# Altium schematic sheet DC_Switch_2.SchDoc
size A2
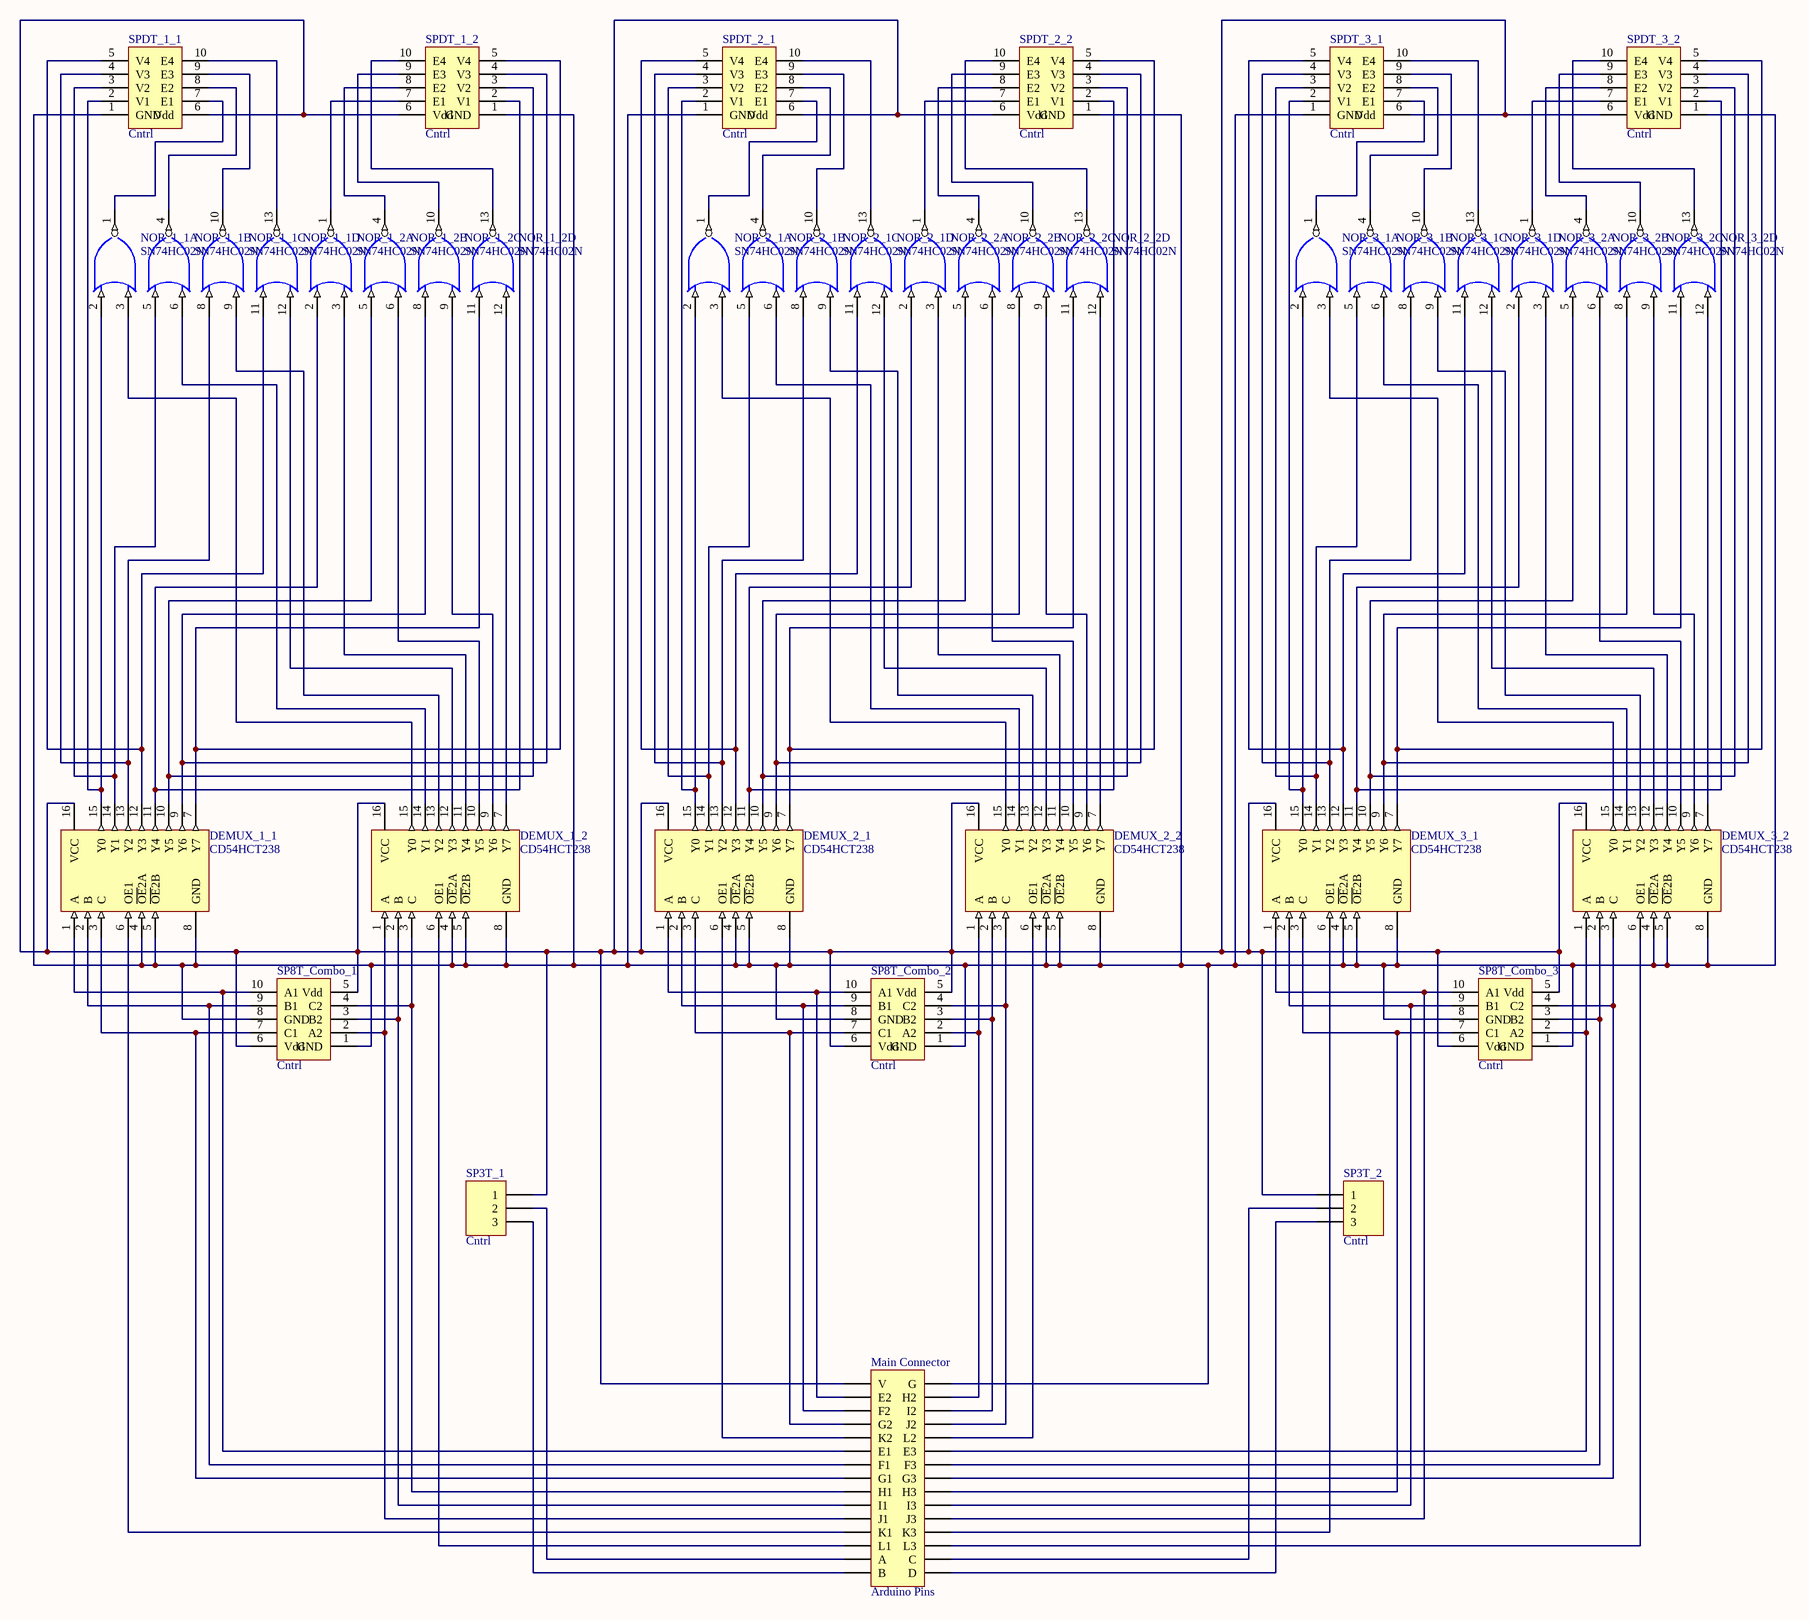
[diagram p0: DC_Switch_2.SchDoc]

## Parts
DEMUX_1_1  CD54HCT238  [J016D]
DEMUX_1_2  CD54HCT238  [J016D]
DEMUX_2_1  CD54HCT238  [J016D]
DEMUX_2_2  CD54HCT238  [J016D]
DEMUX_3_1  CD54HCT238  [J016D]
DEMUX_3_2  CD54HCT238  [J016D]
Main_Connector  Arduino Pins  [HDR2X15_CEN]
NOR_1_1  SN74HC02N  [N014]  (parts A,B,C,D of 4)
NOR_1_2  SN74HC02N  [N014]  (parts A,B,C,D of 4)
NOR_2_1  SN74HC02N  [N014]  (parts A,B,C,D of 4)
NOR_2_2  SN74HC02N  [N014]  (parts A,B,C,D of 4)
NOR_3_1  SN74HC02N  [N014]  (parts A,B,C,D of 4)
NOR_3_2  SN74HC02N  [N014]  (parts A,B,C,D of 4)
SP3T_1  Cntrl  [HDR1X3]
SP3T_2  Cntrl  [HDR1X3]
SP8T_Combo_1  Cntrl  [HDR2X5_CEN]
SP8T_Combo_2  Cntrl  [HDR2X5_CEN]
SP8T_Combo_3  Cntrl  [HDR2X5_CEN]
SPDT_1_1  Cntrl  [HDR2X5_CEN]
SPDT_1_2  Cntrl  [HDR2X5_CEN]
SPDT_2_1  Cntrl  [HDR2X5_CEN]
SPDT_2_2  Cntrl  [HDR2X5_CEN]
SPDT_3_1  Cntrl  [HDR2X5_CEN]
SPDT_3_2  Cntrl  [HDR2X5_CEN]

## Nets
GND: NOR_1_1.7(GND) NOR_1_2.7(GND) NOR_2_1.7(GND) NOR_2_2.7(GND) NOR_3_1.7(GND) NOR_3_2.7(GND)
VCC: NOR_1_1.14(VCC) NOR_1_2.14(VCC) NOR_2_1.14(VCC) NOR_2_2.14(VCC) NOR_3_1.14(VCC) NOR_3_2.14(VCC)
NetDEMUX_1_1_1: DEMUX_1_1.1(A) Main_Connector.6(E1) SP8T_Combo_1.10(A1)
NetDEMUX_1_1_2: DEMUX_1_1.2(B) Main_Connector.7(F1) SP8T_Combo_1.9(B1)
NetDEMUX_1_1_3: DEMUX_1_1.3(C) Main_Connector.8(G1) SP8T_Combo_1.7(C1)
NetDEMUX_1_1_4: DEMUX_1_1.4(~{OE}2A) DEMUX_1_1.5(~{OE}2B) DEMUX_1_1.8(GND) DEMUX_1_2.4(~{OE}2A) DEMUX_1_2.5(~{OE}2B) DEMUX_1_2.8(GND) DEMUX_2_1.4(~{OE}2A) DEMUX_2_1.5(~{OE}2B) DEMUX_2_1.8(GND) DEMUX_2_2.4(~{OE}2A) DEMUX_2_2.5(~{OE}2B) DEMUX_2_2.8(GND) DEMUX_3_1.4(~{OE}2A) DEMUX_3_1.5(~{OE}2B) DEMUX_3_1.8(GND) DEMUX_3_2.4(~{OE}2A) DEMUX_3_2.5(~{OE}2B) DEMUX_3_2.8(GND) Main_Connector.16(G) SP8T_Combo_1.1(GND) SP8T_Combo_1.8(GND) SP8T_Combo_2.1(GND) SP8T_Combo_2.8(GND) SP8T_Combo_3.1(GND) SP8T_Combo_3.8(GND) SPDT_1_1.1(GND) SPDT_1_2.1(GND) SPDT_2_1.1(GND) SPDT_2_2.1(GND) SPDT_3_1.1(GND) SPDT_3_2.1(GND)
NetDEMUX_1_1_6: DEMUX_1_1.6(OE1) Main_Connector.12(K1)
NetDEMUX_1_1_7: DEMUX_1_1.7(Y7) NOR_1_2.11(A) SPDT_1_2.5(V4)
NetDEMUX_1_1_9: DEMUX_1_1.9(Y6) NOR_1_2.8(A) SPDT_1_2.4(V3)
NetDEMUX_1_1_10: DEMUX_1_1.10(Y5) NOR_1_2.5(A) SPDT_1_2.3(V2)
NetDEMUX_1_1_11: DEMUX_1_1.11(Y4) NOR_1_2.2(A) SPDT_1_2.2(V1)
NetDEMUX_1_1_12: DEMUX_1_1.12(Y3) NOR_1_1.11(A) SPDT_1_1.5(V4)
NetDEMUX_1_1_13: DEMUX_1_1.13(Y2) NOR_1_1.8(A) SPDT_1_1.4(V3)
NetDEMUX_1_1_14: DEMUX_1_1.14(Y1) NOR_1_1.5(A) SPDT_1_1.3(V2)
NetDEMUX_1_1_15: DEMUX_1_1.15(Y0) NOR_1_1.2(A) SPDT_1_1.2(V1)
NetDEMUX_1_1_16: DEMUX_1_1.16(VCC) DEMUX_1_2.16(VCC) DEMUX_2_1.16(VCC) DEMUX_2_2.16(VCC) DEMUX_3_1.16(VCC) DEMUX_3_2.16(VCC) Main_Connector.1(V) SP3T_1.1 SP3T_2.1 SP8T_Combo_1.5(Vdd) SP8T_Combo_1.6(Vdd) SP8T_Combo_2.5(Vdd) SP8T_Combo_2.6(Vdd) SP8T_Combo_3.5(Vdd) SP8T_Combo_3.6(Vdd) SPDT_1_1.6(Vdd) SPDT_1_2.6(Vdd) SPDT_2_1.6(Vdd) SPDT_2_2.6(Vdd) SPDT_3_1.6(Vdd) SPDT_3_2.6(Vdd)
NetDEMUX_1_2_1: DEMUX_1_2.1(A) Main_Connector.11(J1) SP8T_Combo_1.2(A2)
NetDEMUX_1_2_2: DEMUX_1_2.2(B) Main_Connector.10(I1) SP8T_Combo_1.3(B2)
NetDEMUX_1_2_3: DEMUX_1_2.3(C) Main_Connector.9(H1) SP8T_Combo_1.4(C2)
NetDEMUX_1_2_6: DEMUX_1_2.6(OE1) Main_Connector.13(L1)
NetDEMUX_1_2_7: DEMUX_1_2.7(Y7) NOR_1_2.12(B)
NetDEMUX_1_2_9: DEMUX_1_2.9(Y6) NOR_1_2.9(B)
NetDEMUX_1_2_10: DEMUX_1_2.10(Y5) NOR_1_2.6(B)
NetDEMUX_1_2_11: DEMUX_1_2.11(Y4) NOR_1_2.3(B)
NetDEMUX_1_2_12: DEMUX_1_2.12(Y3) NOR_1_1.12(B)
NetDEMUX_1_2_13: DEMUX_1_2.13(Y2) NOR_1_1.9(B)
NetDEMUX_1_2_14: DEMUX_1_2.14(Y1) NOR_1_1.6(B)
NetDEMUX_1_2_15: DEMUX_1_2.15(Y0) NOR_1_1.3(B)
NetDEMUX_2_1_1: DEMUX_2_1.1(A) Main_Connector.2(E2) SP8T_Combo_2.10(A1)
NetDEMUX_2_1_2: DEMUX_2_1.2(B) Main_Connector.3(F2) SP8T_Combo_2.9(B1)
NetDEMUX_2_1_3: DEMUX_2_1.3(C) Main_Connector.4(G2) SP8T_Combo_2.7(C1)
NetDEMUX_2_1_6: DEMUX_2_1.6(OE1) Main_Connector.5(K2)
NetDEMUX_2_1_7: DEMUX_2_1.7(Y7) NOR_2_2.11(A) SPDT_2_2.5(V4)
NetDEMUX_2_1_9: DEMUX_2_1.9(Y6) NOR_2_2.8(A) SPDT_2_2.4(V3)
NetDEMUX_2_1_10: DEMUX_2_1.10(Y5) NOR_2_2.5(A) SPDT_2_2.3(V2)
NetDEMUX_2_1_11: DEMUX_2_1.11(Y4) NOR_2_2.2(A) SPDT_2_2.2(V1)
NetDEMUX_2_1_12: DEMUX_2_1.12(Y3) NOR_2_1.11(A) SPDT_2_1.5(V4)
NetDEMUX_2_1_13: DEMUX_2_1.13(Y2) NOR_2_1.8(A) SPDT_2_1.4(V3)
NetDEMUX_2_1_14: DEMUX_2_1.14(Y1) NOR_2_1.5(A) SPDT_2_1.3(V2)
NetDEMUX_2_1_15: DEMUX_2_1.15(Y0) NOR_2_1.2(A) SPDT_2_1.2(V1)
NetDEMUX_2_2_1: DEMUX_2_2.1(A) Main_Connector.17(H2) SP8T_Combo_2.2(A2)
NetDEMUX_2_2_2: DEMUX_2_2.2(B) Main_Connector.18(I2) SP8T_Combo_2.3(B2)
NetDEMUX_2_2_3: DEMUX_2_2.3(C) Main_Connector.19(J2) SP8T_Combo_2.4(C2)
NetDEMUX_2_2_6: DEMUX_2_2.6(OE1) Main_Connector.20(L2)
NetDEMUX_2_2_7: DEMUX_2_2.7(Y7) NOR_2_2.12(B)
NetDEMUX_2_2_9: DEMUX_2_2.9(Y6) NOR_2_2.9(B)
NetDEMUX_2_2_10: DEMUX_2_2.10(Y5) NOR_2_2.6(B)
NetDEMUX_2_2_11: DEMUX_2_2.11(Y4) NOR_2_2.3(B)
NetDEMUX_2_2_12: DEMUX_2_2.12(Y3) NOR_2_1.12(B)
NetDEMUX_2_2_13: DEMUX_2_2.13(Y2) NOR_2_1.9(B)
NetDEMUX_2_2_14: DEMUX_2_2.14(Y1) NOR_2_1.6(B)
NetDEMUX_2_2_15: DEMUX_2_2.15(Y0) NOR_2_1.3(B)
NetDEMUX_3_1_1: DEMUX_3_1.1(A) Main_Connector.26(J3) SP8T_Combo_3.10(A1)
NetDEMUX_3_1_2: DEMUX_3_1.2(B) Main_Connector.25(I3) SP8T_Combo_3.9(B1)
NetDEMUX_3_1_3: DEMUX_3_1.3(C) Main_Connector.24(H3) SP8T_Combo_3.7(C1)
NetDEMUX_3_1_6: DEMUX_3_1.6(OE1) Main_Connector.27(K3)
NetDEMUX_3_1_7: DEMUX_3_1.7(Y7) NOR_3_2.11(A) SPDT_3_2.5(V4)
NetDEMUX_3_1_9: DEMUX_3_1.9(Y6) NOR_3_2.8(A) SPDT_3_2.4(V3)
NetDEMUX_3_1_10: DEMUX_3_1.10(Y5) NOR_3_2.5(A) SPDT_3_2.3(V2)
NetDEMUX_3_1_11: DEMUX_3_1.11(Y4) NOR_3_2.2(A) SPDT_3_2.2(V1)
NetDEMUX_3_1_12: DEMUX_3_1.12(Y3) NOR_3_1.11(A) SPDT_3_1.5(V4)
NetDEMUX_3_1_13: DEMUX_3_1.13(Y2) NOR_3_1.8(A) SPDT_3_1.4(V3)
NetDEMUX_3_1_14: DEMUX_3_1.14(Y1) NOR_3_1.5(A) SPDT_3_1.3(V2)
NetDEMUX_3_1_15: DEMUX_3_1.15(Y0) NOR_3_1.2(A) SPDT_3_1.2(V1)
NetDEMUX_3_2_1: DEMUX_3_2.1(A) Main_Connector.21(E3) SP8T_Combo_3.2(A2)
NetDEMUX_3_2_2: DEMUX_3_2.2(B) Main_Connector.22(F3) SP8T_Combo_3.3(B2)
NetDEMUX_3_2_3: DEMUX_3_2.3(C) Main_Connector.23(G3) SP8T_Combo_3.4(C2)
NetDEMUX_3_2_6: DEMUX_3_2.6(OE1) Main_Connector.28(L3)
NetDEMUX_3_2_7: DEMUX_3_2.7(Y7) NOR_3_2.12(B)
NetDEMUX_3_2_9: DEMUX_3_2.9(Y6) NOR_3_2.9(B)
NetDEMUX_3_2_10: DEMUX_3_2.10(Y5) NOR_3_2.6(B)
NetDEMUX_3_2_11: DEMUX_3_2.11(Y4) NOR_3_2.3(B)
NetDEMUX_3_2_12: DEMUX_3_2.12(Y3) NOR_3_1.12(B)
NetDEMUX_3_2_13: DEMUX_3_2.13(Y2) NOR_3_1.9(B)
NetDEMUX_3_2_14: DEMUX_3_2.14(Y1) NOR_3_1.6(B)
NetDEMUX_3_2_15: DEMUX_3_2.15(Y0) NOR_3_1.3(B)
NetMain_Connector_14: Main_Connector.14(A) SP3T_1.2
NetMain_Connector_15: Main_Connector.15(B) SP3T_1.3
NetMain_Connector_29: Main_Connector.29(C) SP3T_2.2
NetMain_Connector_30: Main_Connector.30(D) SP3T_2.3
NetNOR_1_1_1: NOR_1_1.1(Y) SPDT_1_1.7(E1)
NetNOR_1_1_4: NOR_1_1.4(Y) SPDT_1_1.8(E2)
NetNOR_1_1_10: NOR_1_1.10(Y) SPDT_1_1.9(E3)
NetNOR_1_1_13: NOR_1_1.13(Y) SPDT_1_1.10(E4)
NetNOR_1_2_1: NOR_1_2.1(Y) SPDT_1_2.7(E1)
NetNOR_1_2_4: NOR_1_2.4(Y) SPDT_1_2.8(E2)
NetNOR_1_2_10: NOR_1_2.10(Y) SPDT_1_2.9(E3)
NetNOR_1_2_13: NOR_1_2.13(Y) SPDT_1_2.10(E4)
NetNOR_2_1_1: NOR_2_1.1(Y) SPDT_2_1.7(E1)
NetNOR_2_1_4: NOR_2_1.4(Y) SPDT_2_1.8(E2)
NetNOR_2_1_10: NOR_2_1.10(Y) SPDT_2_1.9(E3)
NetNOR_2_1_13: NOR_2_1.13(Y) SPDT_2_1.10(E4)
NetNOR_2_2_1: NOR_2_2.1(Y) SPDT_2_2.7(E1)
NetNOR_2_2_4: NOR_2_2.4(Y) SPDT_2_2.8(E2)
NetNOR_2_2_10: NOR_2_2.10(Y) SPDT_2_2.9(E3)
NetNOR_2_2_13: NOR_2_2.13(Y) SPDT_2_2.10(E4)
NetNOR_3_1_1: NOR_3_1.1(Y) SPDT_3_1.7(E1)
NetNOR_3_1_4: NOR_3_1.4(Y) SPDT_3_1.8(E2)
NetNOR_3_1_10: NOR_3_1.10(Y) SPDT_3_1.9(E3)
NetNOR_3_1_13: NOR_3_1.13(Y) SPDT_3_1.10(E4)
NetNOR_3_2_1: NOR_3_2.1(Y) SPDT_3_2.7(E1)
NetNOR_3_2_4: NOR_3_2.4(Y) SPDT_3_2.8(E2)
NetNOR_3_2_10: NOR_3_2.10(Y) SPDT_3_2.9(E3)
NetNOR_3_2_13: NOR_3_2.13(Y) SPDT_3_2.10(E4)

## Library data of the parts
DEMUX_1_1 DEMUX_1_2 DEMUX_2_1 DEMUX_2_2 DEMUX_3_1 DEMUX_3_2 = SN54HC238J: 3-Line to 8-Line Decoder / Demultiplexer; Published: 8-Jun-2000; LatestRevisionDate: 04-Mar-2005; LatestRevisionNote: Stylized 3D Model Added.; DatasheetVersion: Jun-1989; PackageVersion: Jun-1999; PackageReference: J016D; Publisher: Altium Limited; PackageDescription: DIP; 16 Leads; Row Spacing 7.62 mm; Pitch 2.54 mm; ComponentLink1Description: Manufacturer Link; ComponentLink1URL: http://www.ti.com/
Main_Connector = Header 15X2A: Header, 15-Pin, Dual row; LatestRevisionDate: 17-Jul-2002; LatestRevisionNote: Re-released for DXP Platform.; Publisher: Altium Limited
NOR_1_1 NOR_1_2 NOR_2_1 NOR_2_2 NOR_3_1 NOR_3_2 = SN74HC02N: Quadruple 2-Input Positive-NOR Gate; Published: 8-Jun-2000; LatestRevisionDate: 04-Mar-2005; LatestRevisionNote: Stylized 3D Model Added.; DatasheetVersion: May-1997; PackageVersion: Oct-1995; PackageReference: N014; Publisher: Altium Limited; PackageDescription: DIP; 14 Leads; Row Spacing 7.62 mm; Pitch 2.54 mm; ComponentLink1Description: Manufacturer Link; ComponentLink1URL: http://www.ti.com/; ComponentLink2Description: Datasheet; ComponentLink2URL: http://www-s.ti.com/sc/ds/sn74hc02.pdf
SP3T_1 SP3T_2 = Header 3: Header, 3-Pin; LatestRevisionDate: 17-Jul-2002; LatestRevisionNote: Re-released for DXP Platform.; Publisher: Altium Limited
SP8T_Combo_1-SP8T_Combo_3 SPDT_1_1 SPDT_1_2 SPDT_2_1 SPDT_2_2 SPDT_3_1 SPDT_3_2 = Header 5X2A: Header, 5-Pin, Dual row; LatestRevisionDate: 17-Jul-2002; LatestRevisionNote: Re-released for DXP Platform.; Publisher: Altium Limited